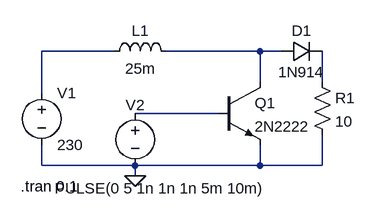
[diagram p0: schematic StepUp_Chopper_R.asc]
StepUp_Chopper_R.asc, the LTspice schematic file:
Version 4
SHEET 1 880 680
WIRE 144 96 32 96
WIRE 368 96 224 96
WIRE 400 96 368 96
WIRE 368 144 368 96
WIRE 464 144 464 96
WIRE 32 160 32 96
WIRE 304 192 176 192
WIRE 32 272 32 240
WIRE 176 272 32 272
WIRE 368 272 368 240
WIRE 368 272 176 272
WIRE 464 272 464 224
WIRE 464 272 368 272
WIRE 176 288 176 272
FLAG 176 288 0
SYMBOL voltage 32 144 R0
WINDOW 123 0 0 Left 0
WINDOW 39 0 0 Left 0
SYMATTR InstName V1
SYMATTR Value 230
SYMBOL res 448 128 R0
SYMATTR InstName R1
SYMATTR Value 10
SYMBOL npn 304 144 R0
SYMATTR InstName Q1
SYMATTR Value 2N2222
SYMBOL voltage 176 176 R0
WINDOW 0 0 -13 Top 2
WINDOW 3 38 147 Bottom 2
WINDOW 123 0 0 Left 0
WINDOW 39 0 0 Left 0
SYMATTR InstName V2
SYMATTR Value PULSE(0 5 1n 1n 1n 5m 10m)
SYMBOL diode 400 112 R270
WINDOW 0 32 32 VTop 2
WINDOW 3 0 32 VBottom 2
SYMATTR InstName D1
SYMATTR Value 1N914
SYMBOL ind 128 112 R270
WINDOW 0 32 56 VTop 2
WINDOW 3 5 56 VBottom 2
SYMATTR InstName L1
SYMATTR Value 25m
TEXT 0 304 Left 2 !.tran 0.1

The netlist it stands for:
* StepUp_Chopper_R.asc
V1 N001 0 230
R1 N003 0 10
Q1 N002 N004 0 0 2N2222
V2 N004 0 PULSE(0 5 1n 1n 1n 5m 10m)
D1 N002 N003 1N914
L1 N001 N002 25m
.model D D
.lib standard.dio
.model NPN NPN
.model PNP PNP
.lib standard.bjt
.tran 0.1
.backanno
.end